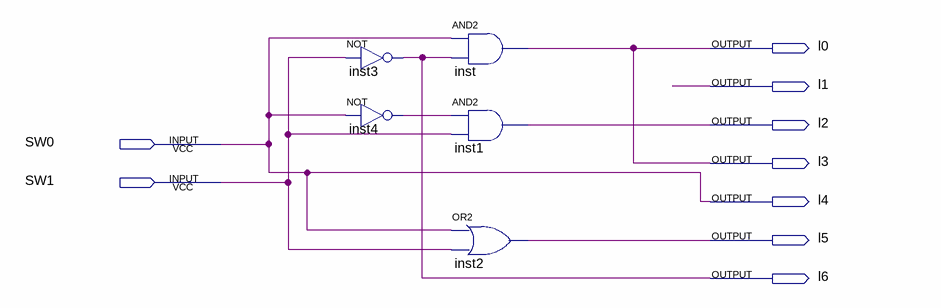
[diagram p0: schematic sheet]
// Quartus schematic BINBCD1.bdf as structural Verilog: 5 symbols, 9 pins
module BINBCD1 (
  input  SW0,
  input  SW1,
  output l0,
  output l1,
  output l2,
  output l3,
  output l4,
  output l5,
  output l6
);

  wire inst4_out;

  not inst3 (l6, SW1);
  not inst4 (inst4_out, SW0);
  and inst (l0, SW0, l6);
  and inst1 (l2, inst4_out, SW1);
  or inst2 (l5, SW0, SW1);

  assign l3 = l0;
  assign l4 = SW0;
endmodule
